# Altium project YC0098_JPXP H93 EOL BASE Tester wiring drawing.PrjPcb
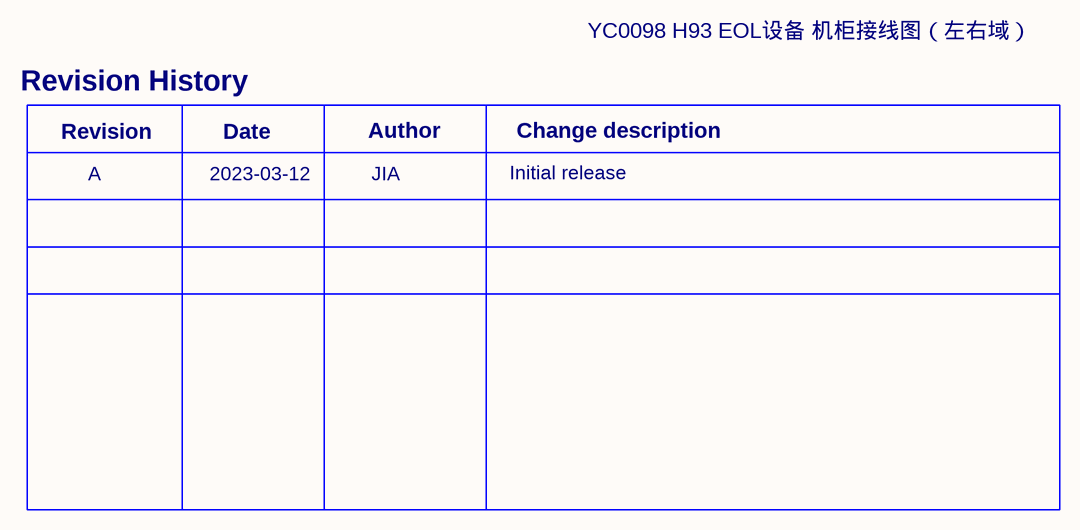
[diagram p0: 0_wiring drawing.SchDoc]
5 sheets, 4 parts. Net scope: flat (ports and power ports of the same name join across sheets).
Sheets:
  0_wiring drawing.SchDoc
  1_wiring drawing.SchDoc
  2_wiring drawing.SchDoc
  3_wiring drawing.SchDoc
  4_wiring drawing.SchDoc

## Sheet 0_wiring drawing.SchDoc: History
size A4; CheckedBy: Among; DrawnBy: Jack; Address1: 1; Address2: 2; Address3: 3; Address4: 4; DocumentNumber: 04-TE-42-4015-0PA-A; Revision: B; SheetNumber: 1; SheetTotal: 5; SheetSize: A4; CheckedByDate: 2022-01-11; DrawByDate: 2022-01-11; SiteName: Huangpu Test Development; ProjectName: 19205_BMW CCU DDR PCBA FT fixture wiring

### Notes on the sheet
- YC0098 H93 EOL设备 机柜接线图（左右域）
- Revision History
- Revision
- Date
- Author
- Initial release
- Change description
- A
- 2023-03-12
- JIA
- Document Number:
- Project Name:
- Rev:
- Drawn By:
- Date:
- Titile:
- Checked By:
- Sheet:
- Of

## Sheet 1_wiring drawing.SchDoc: CAN HUB
size A2; ApprovedBy: Approved By; CheckedBy: Sky; DrawnBy: Jack; Address1: 1; Address2: 2; Address3: 3; Address4: 4; DocumentNumber: 04-TE-42-4015-0PA-A; Revision: B; SheetNumber: 2; SheetTotal: 6; SheetSize: A2; CheckedByDate: 2022-11-19; DrawByDate: 2022-11-17; SiteName: EMS TD Huangpu; PageSetup: Record=PageOptions|CenterHorizontal=True|CenterVertical=True|PrintScale=0.73|XCorrection=1.00|YCorrection=1.00|PrintKind=0|BorderSize=5000000|LeftOffset=0|BottomOffset=0|Orientation=2|PaperLength=1000|PaperWidth=1000|Scale=100|PaperSource=15|PrintQuality=1200|MediaType=1|DitherType=10|PaperKind=A3|PrintScaleMode=1; ProjectName: 19205_BMW CCU DDR PCBA FT fixture wiring
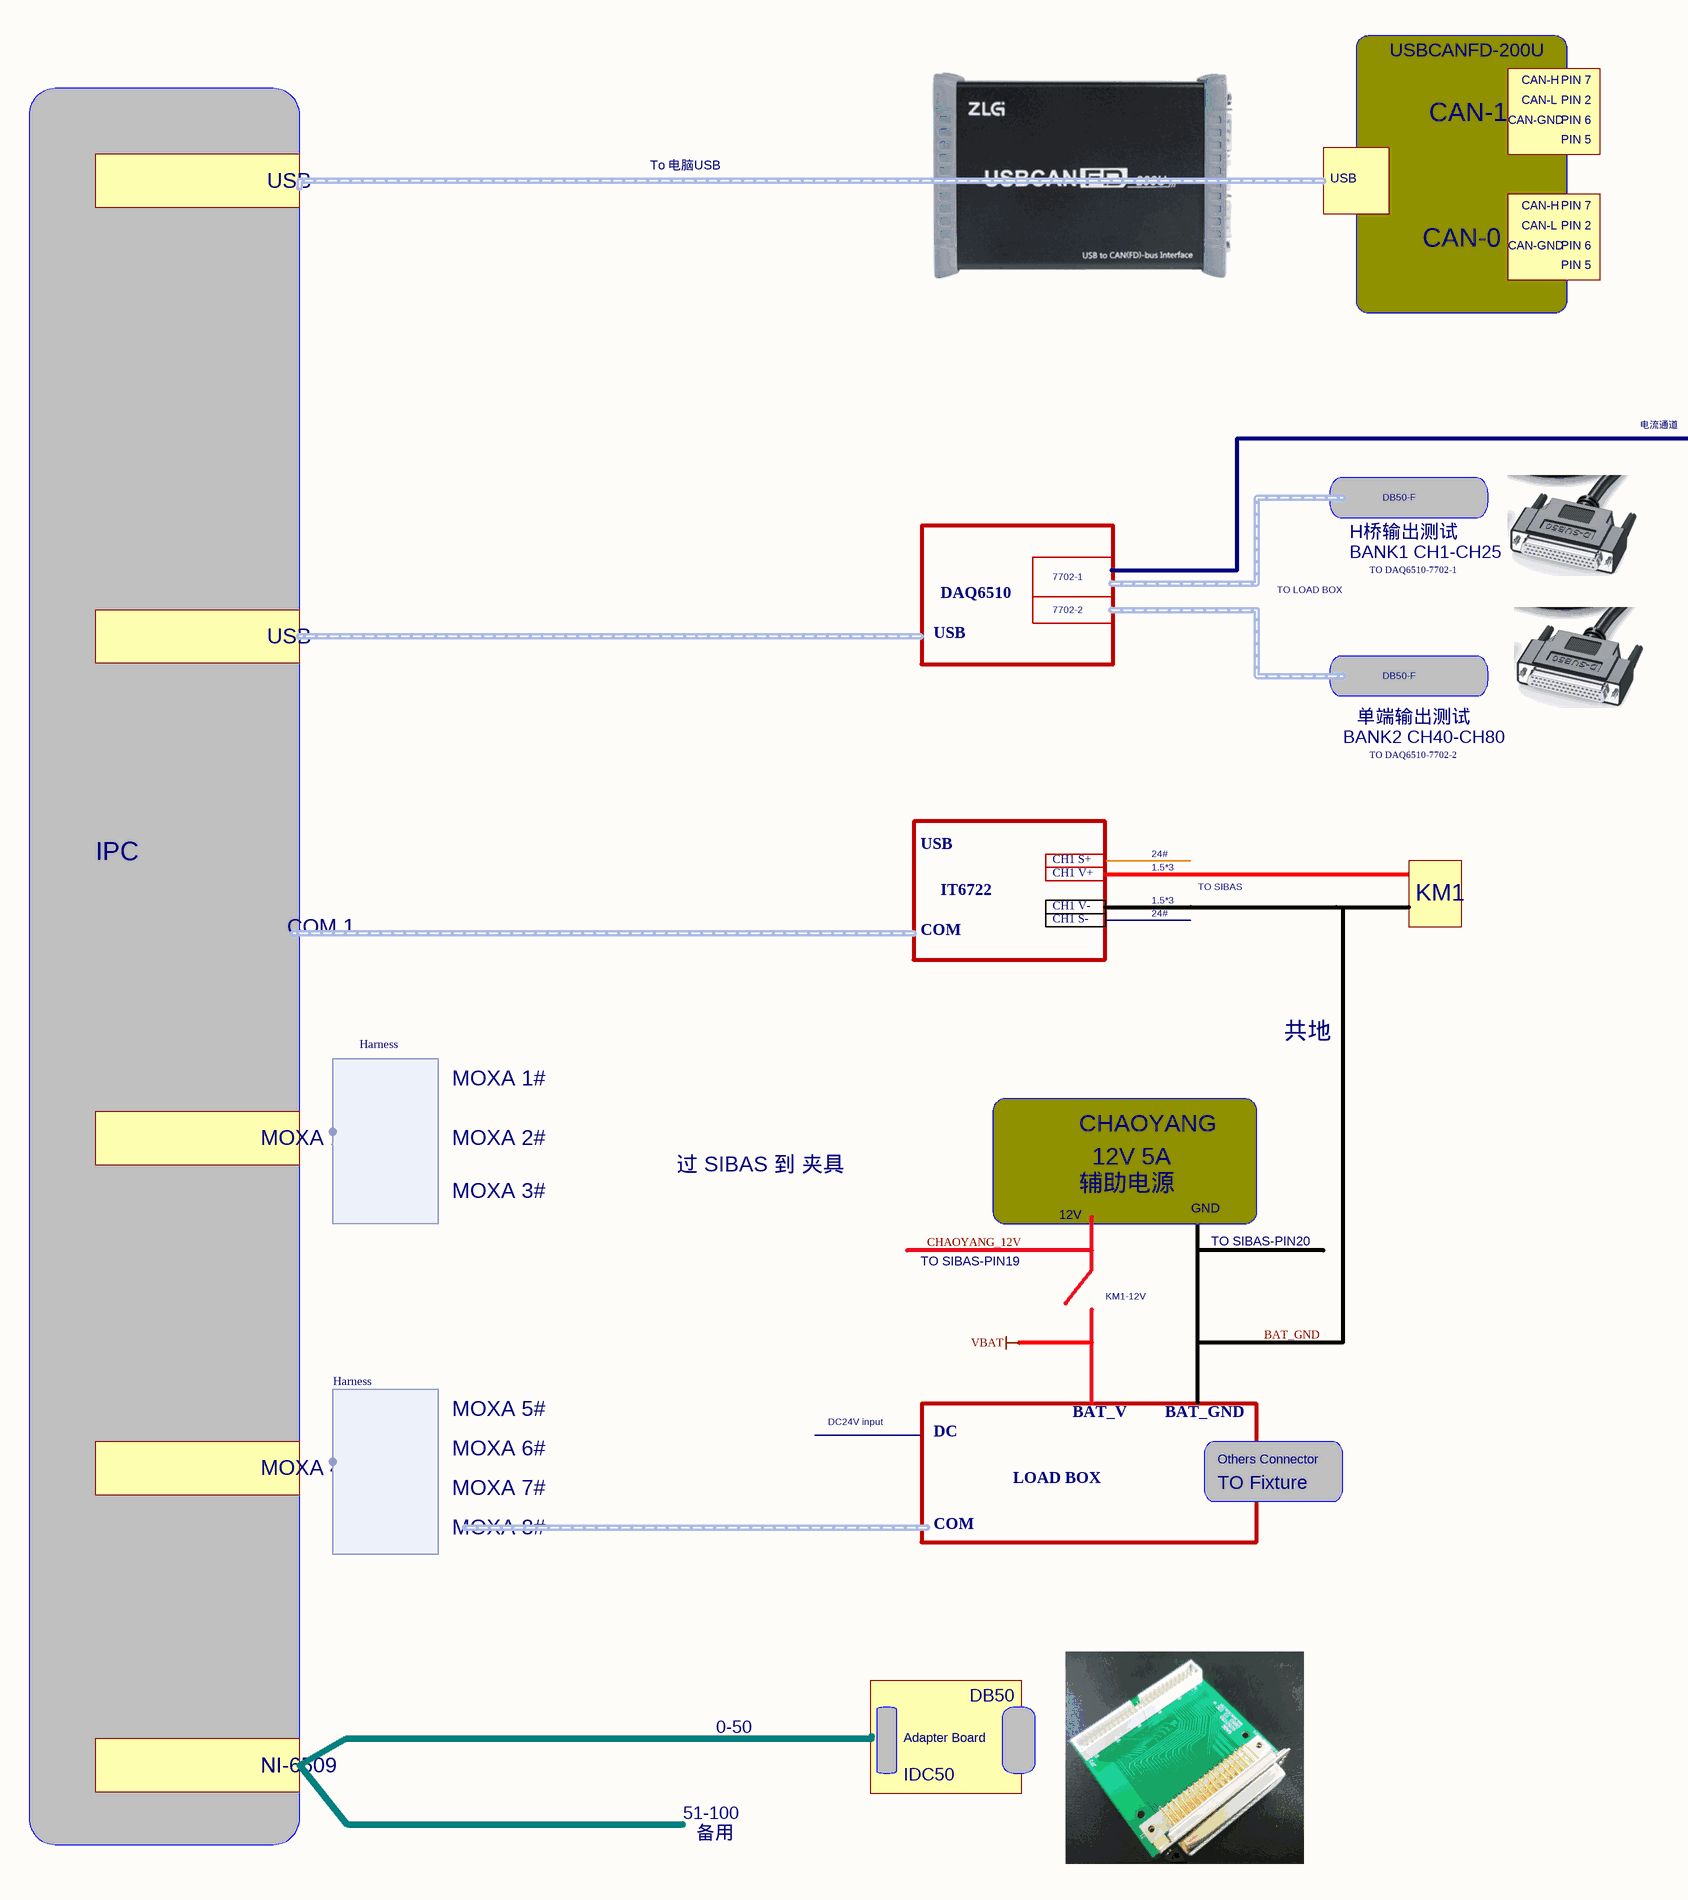
[diagram p1: 1_wiring drawing.SchDoc, left]
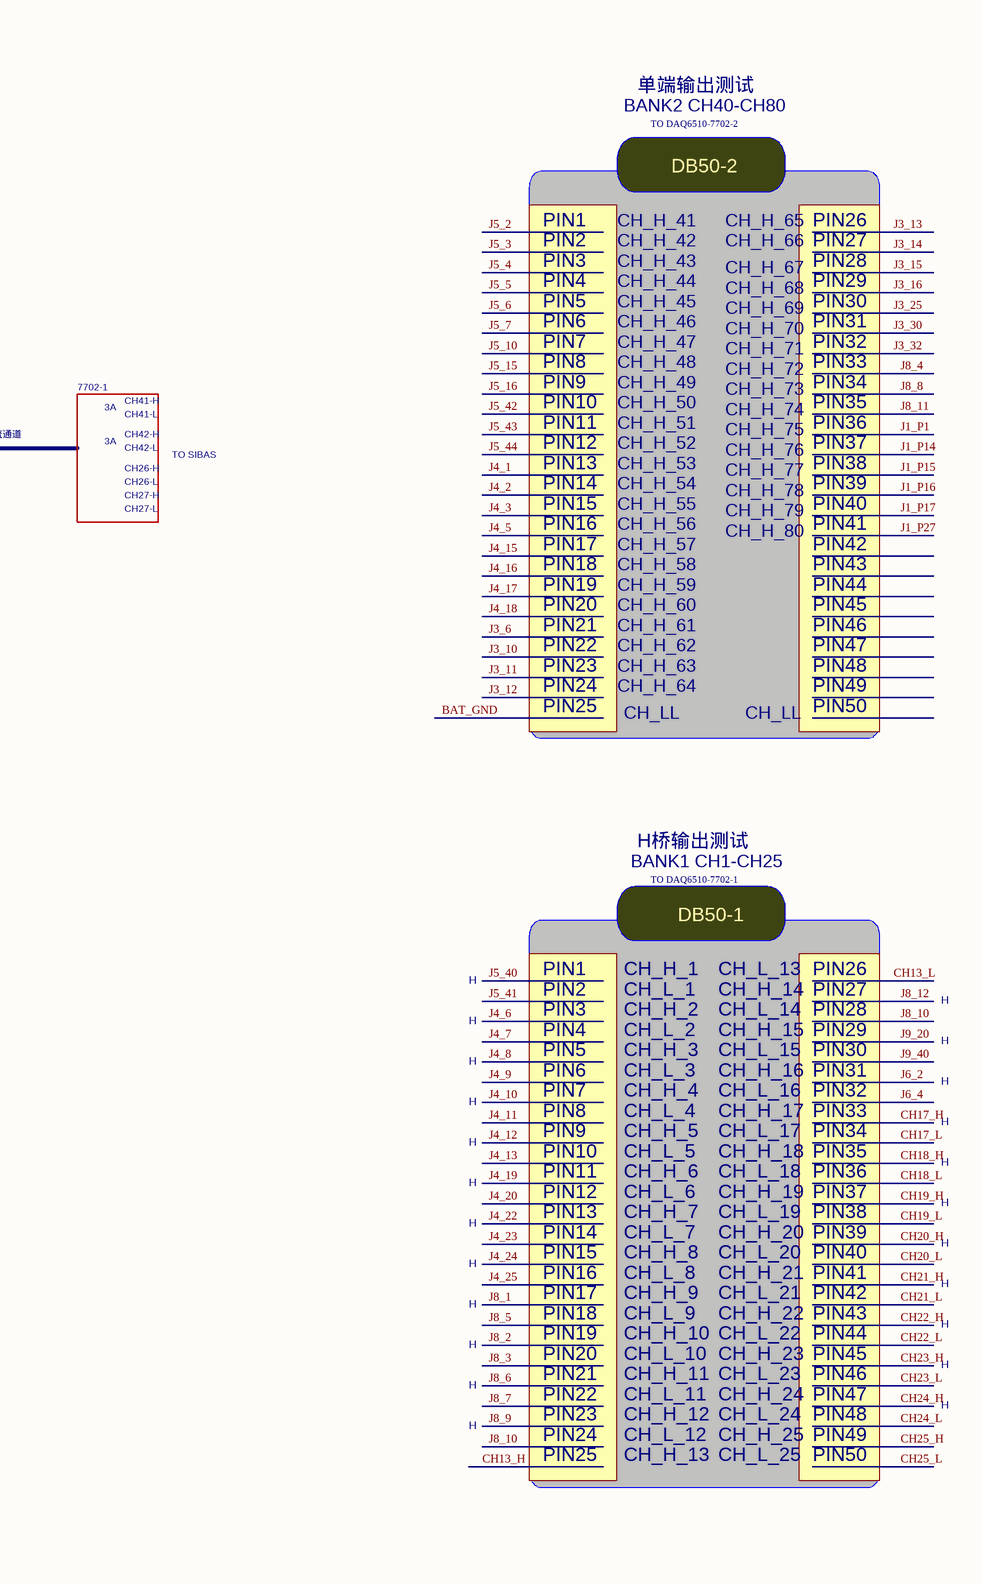
[diagram p2: 1_wiring drawing.SchDoc, right]

### Harnesses
Harness: 

### Notes on the sheet
- USBCANFD-200U
- CAN-H
- CAN-L
- PIN 2
- PIN 7
- BANK2 CH40-CH80
- 单端输出测试
- To 电脑USB
- USB
- CAN-1
- CAN-GND
- PIN 6
- PIN 5
- TO DAQ6510-7702-2
- DB50-2
- PIN1
- PIN2
- CH_H_41
- CH_H_42
- CH_H_65
- CH_H_66
- PIN26
- PIN27
- CAN-0
- PIN3
- PIN4
- PIN5
- CH_H_43
- CH_H_44
- CH_H_45
- CH_H_67
- CH_H_68
- CH_H_69
- PIN28
- PIN29
- PIN30
- PIN6
- PIN7
- PIN8
- CH_H_46
- CH_H_47
- CH_H_48
- CH_H_70
- CH_H_71
- CH_H_72
- PIN31
- PIN32
- PIN33
- 电流通道
- 7702-1
- 3A
- CH41-H
- CH41-L
- CH42-L
- CH42-H
- TO SIBAS
- PIN9
- PIN10
- PIN11
- PIN12
- CH_H_49
- CH_H_50
- CH_H_51
- CH_H_52
- CH_H_73
- CH_H_74
- CH_H_75
- CH_H_76
- PIN34
- PIN35
- PIN36
- PIN37
- DB50-F
- CH26-H
- CH26-L
- CH27-H
- CH27-L
- PIN13
- PIN14
- PIN15
- CH_H_53
- CH_H_54
- CH_H_55
- CH_H_77
- CH_H_78
- CH_H_79
- PIN38
- PIN39
- PIN40
- H桥输出测试
- BANK1 CH1-CH25
- TO DAQ6510-7702-1
- PIN16
- PIN17
- PIN18
- PIN19
- CH_H_56
- CH_H_57
- CH_H_58
- CH_H_59
- CH_H_80
- PIN41
- PIN42
- PIN43
- PIN44
- DAQ6510
- 7702-2
- TO LOAD BOX
- PIN20
- PIN21
- PIN22
- CH_H_60
- CH_H_61
- CH_H_62
- PIN45
- PIN46
- PIN47
- PIN23
- PIN24
- PIN25
- CH_H_63
- CH_H_64
- CH_LL
- PIN48
- PIN49
- PIN50
- IPC
- IT6722
- 1.5*3
- 24#
- KM1
- DB50-1
- COM 1
- COM
- H
- CH_H_1
- CH_L_1
- CH_H_14
- CH_L_13
- CH_H_2
- CH_H_3
- CH_L_2
- CH_H_15
- CH_L_14
- CH_L_15
- MOXA 1#
- 共地
- CH_H_4
- CH_L_3
- CH_L_4
- CH_H_16
- CH_H_17
- CH_L_16
- MOXA 1-3
- MOXA 2#
- CHAOYANG
- 12V 5A
- CH_H_5
- CH_H_6
- CH_L_5
- CH_H_18
- CH_L_18
- CH_L_17
- MOXA 3#
- 过 SIBAS 到 夹具
- 12V
- 辅助电源
- GND
- CH_H_7
- CH_H_8
- CH_L_6
- CH_L_7
- CH_H_19
- CH_H_20
- CH_L_19
- CH_L_20
- TO SIBAS-PIN19
- KM1-12V
- TO SIBAS-PIN20
- CH_H_9
- CH_L_8
- CH_L_9
- CH_H_21
- CH_H_22
- CH_L_21
- CH_H_10
- CH_H_11
- CH_L_10
- CH_L_11
- CH_H_23
- CH_H_24
- CH_L_22
- CH_L_23
- MOXA 5#
- DC24V input
- BAT_V
- BAT_GND
- CH_H_12
- CH_H_13
- CH_L_12
- CH_H_25
- CH_L_24
- CH_L_25
- MOXA 4-8
- MOXA 6#
- MOXA 7#
- DC
- LOAD BOX
- TO Fixture
- Others Connector
- MOXA 8#
- 0-50
- Adapter Board
- DB50
- NI-6509
- 51-100
- IDC50
- 备用
- Labels drawn without touching a wire or pin: BAT_GND, CH1 S+, CH1 S-, CH1 V+, CH1 V-, CHAOYANG_12V
- Document Number:
- Rev:
- Project Name:
- Drawn By:
- Date:
- Titile:
- Checked By:
- Sheet:
- Of

## Sheet 2_wiring drawing.SchDoc: POWER & IGON
size A2; ApprovedBy: Approved By; CheckedBy: Sky Ma; DrawnBy: Jack; Address1: 1; Address2: 2; Address3: 3; Address4: 4; DocumentNumber: 04-TE-42-4015-0PA-A; Revision: B; SheetNumber: 3; SheetTotal: 6; SheetSize: A2; CheckedByDate: 2022-11-19; DrawByDate: 2022-11-19; SiteName: EMS TD Huangpu; : Record=PageOptions|CenterHorizontal=True|CenterVertical=True|PrintScale=0.73|XCorrection=1.00|YCorrection=1.00|PrintKind=0|BorderSize=5000000|LeftOffset=0|BottomOffset=0|Orientation=2|PaperLength=1000|PaperWidth=1000|Scale=100|PaperSource=15|PrintQuality=1200|MediaType=1|DitherType=10|PaperKind=A3|Pr; PageSetup: Record=PageOptions|CenterHorizontal=True|CenterVertical=True|PrintScale=0.52|XCorrection=1.00|YCorrection=1.00|PrintKind=0|BorderSize=5000000|LeftOffset=0|BottomOffset=0|Orientation=2|PaperLength=1000|PaperWidth=1000|Scale=100|PaperSource=15|PrintQuality=1200|MediaType=1|DitherType=10|PaperKind=A4|PrintScaleMode=1; ProjectName: 19205_BMW CCU DDR PCBA FT fixture wiring
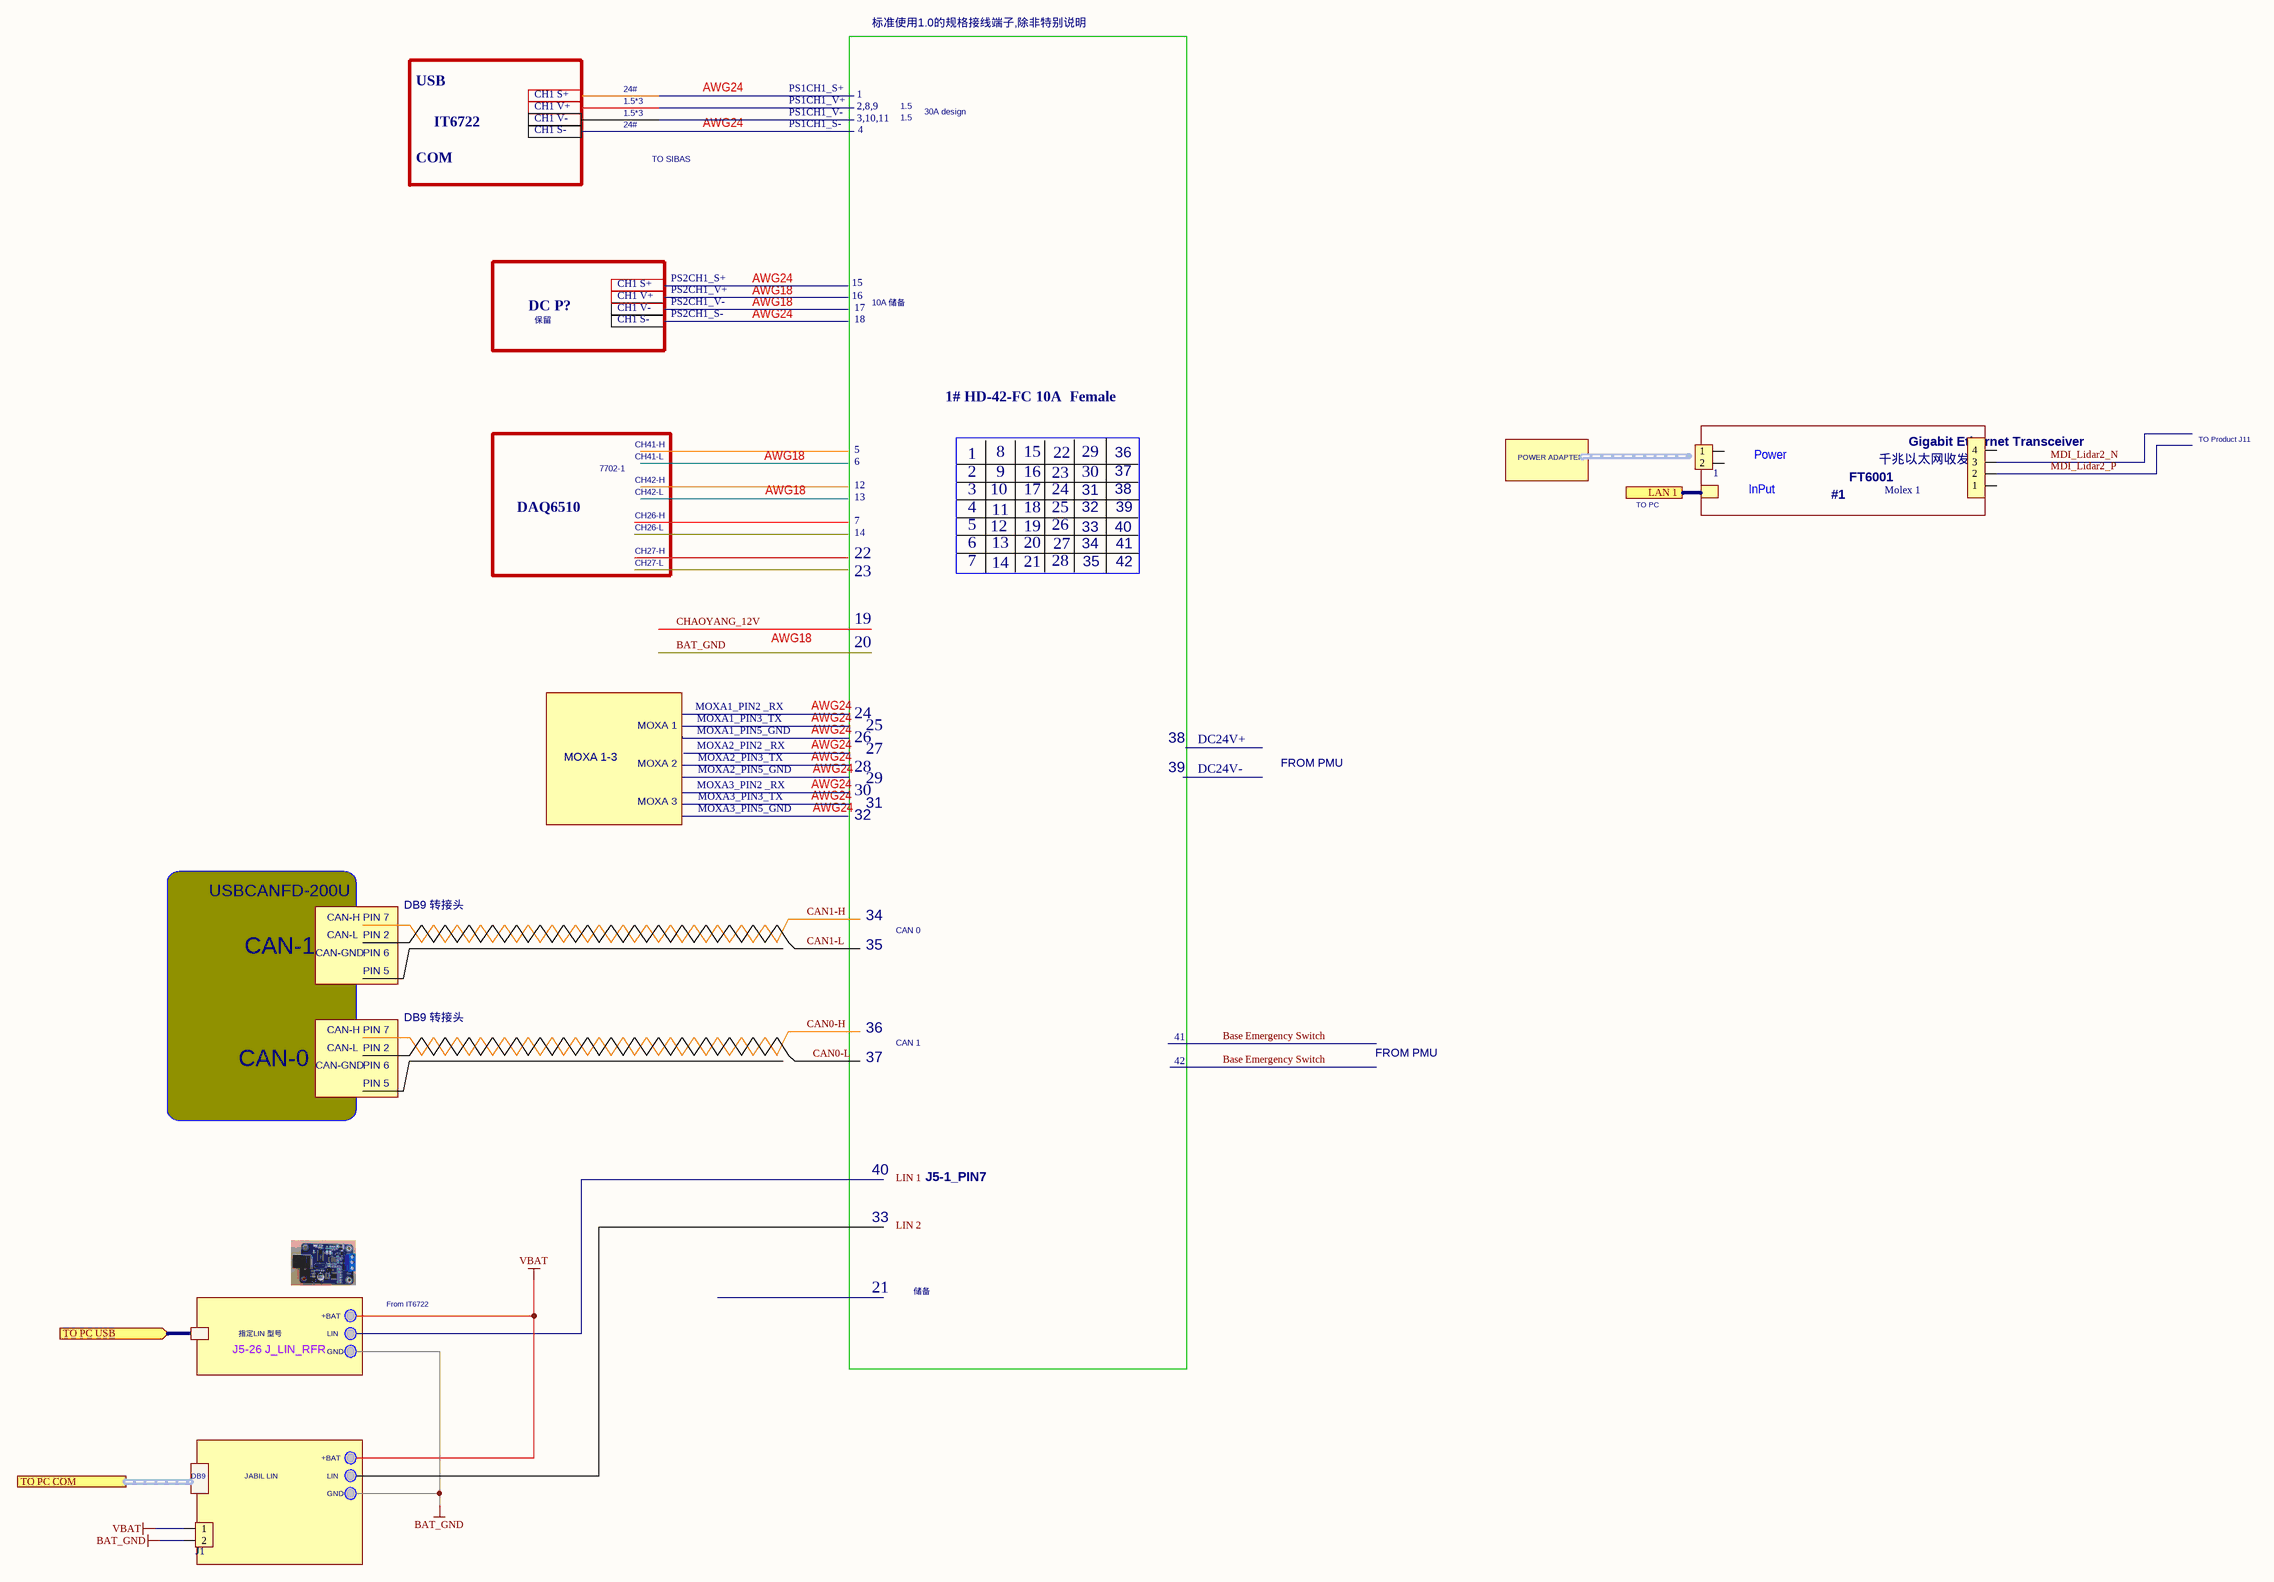
[diagram p3: 2_wiring drawing.SchDoc]

### Parts
1  2.54 connector  [2.54mm-2]  (value not drawn)
J1  5.08mm conncetor  [5.08mm-2-Bend]  (value not drawn)
Molex_1  2.54 connector  [2.54mm-4]  (value not drawn)

### Ports
LAN 1 (in), TO PC COM, TO PC USB (in)

### Nets
BAT_GND: J1.2
VBAT: J1.1
MDI_Lidar2_N: Molex_1.3
MDI_Lidar2_P: Molex_1.2

Not connected (* = marked no-connect by the designer): 1 1 2; Molex_1 1 4

### Notes on the sheet
- 标准使用1.0的规格接线端子,除非特别说明
- USB
- 1.5*3
- 24#
- AWG24
- 1
- 2,8,9
- 3,10,11
- 1.5
- 30A design
- COM
- IT6722
- TO SIBAS
- 4
- AWG18
- 15
- DC P?
- 保留
- 16
- 17
- 18
- 10A 储备
- 1# HD-42-FC 10A  Female
- 7702-1
- CH41-H
- CH41-L
- 6
- 5
- 8
- 22
- 29
- 36
- 37
- POWER ADAPTER
- (near 1) Power
- 千兆以太网收发器
- (near 1) Gigabit Ethernet Transceiver
- TO Product J11
- DAQ6510
- CH42-L
- CH42-H
- CH26-H
- CH26-L
- 12
- 13
- 7
- 2
- 3
- 10
- 11
- 9
- 19
- 23
- 24
- 25
- 26
- 30
- 31
- 32
- 33
- 38
- 40
- 39
- TO PC
- (near 1) InPut
- #1
- FT6001
- CH27-H
- CH27-L
- 14
- 20
- 21
- 28
- 27
- 34
- 35
- 42
- 41
- MOXA 1-3
- MOXA 1
- MOXA 2
- DC24V+
- FROM PMU
- MOXA 3
- DC24V-
- USBCANFD-200U
- CAN-H
- CAN-L
- PIN 2
- PIN 7
- DB9 转接头
- CAN 0
- CAN-1
- CAN-GND
- PIN 6
- PIN 5
- CAN-0
- CAN 1
- J5-1_PIN7
- From IT6722
- 储备
- 指定LIN 型号
- +BAT
- LIN
- GND
- DB9
- JABIL LIN
- Labels drawn without touching a wire or pin: CAN0-H, CAN0-L, CAN1-H, CAN1-L, CH1 S+, CH1 S-, CH1 V+, CH1 V-, J5-26 J_LIN_RFR, LIN 1, LIN 2
- Document Number:
- Rev:
- Project Name:
- Drawn By:
- Date:
- Titile:
- Checked By:
- Sheet:
- Of

### Library data of the parts
1 = CON2-2.54
J1 = CON2-5.08
Molex_1 = CON4-2.54

## Sheet 3_wiring drawing.SchDoc: Current sensors and IFB
size A2; ApprovedBy: Approved By; CheckedBy: Among; DrawnBy: Sky Ma; Address1: 1; Address2: 2; Address3: 3; Address4: 4; DocumentNumber: 04-TE-42-4015-0PA-A; Revision: B; SheetNumber: 4; SheetTotal: 6; SheetSize: A2; CheckedByDate: 2022-01-11; DrawByDate: 2022-11-19; SiteName: EMS TD Huangpu; ProjectName: 19205_BMW CCU DDR PCBA FT fixture wiring
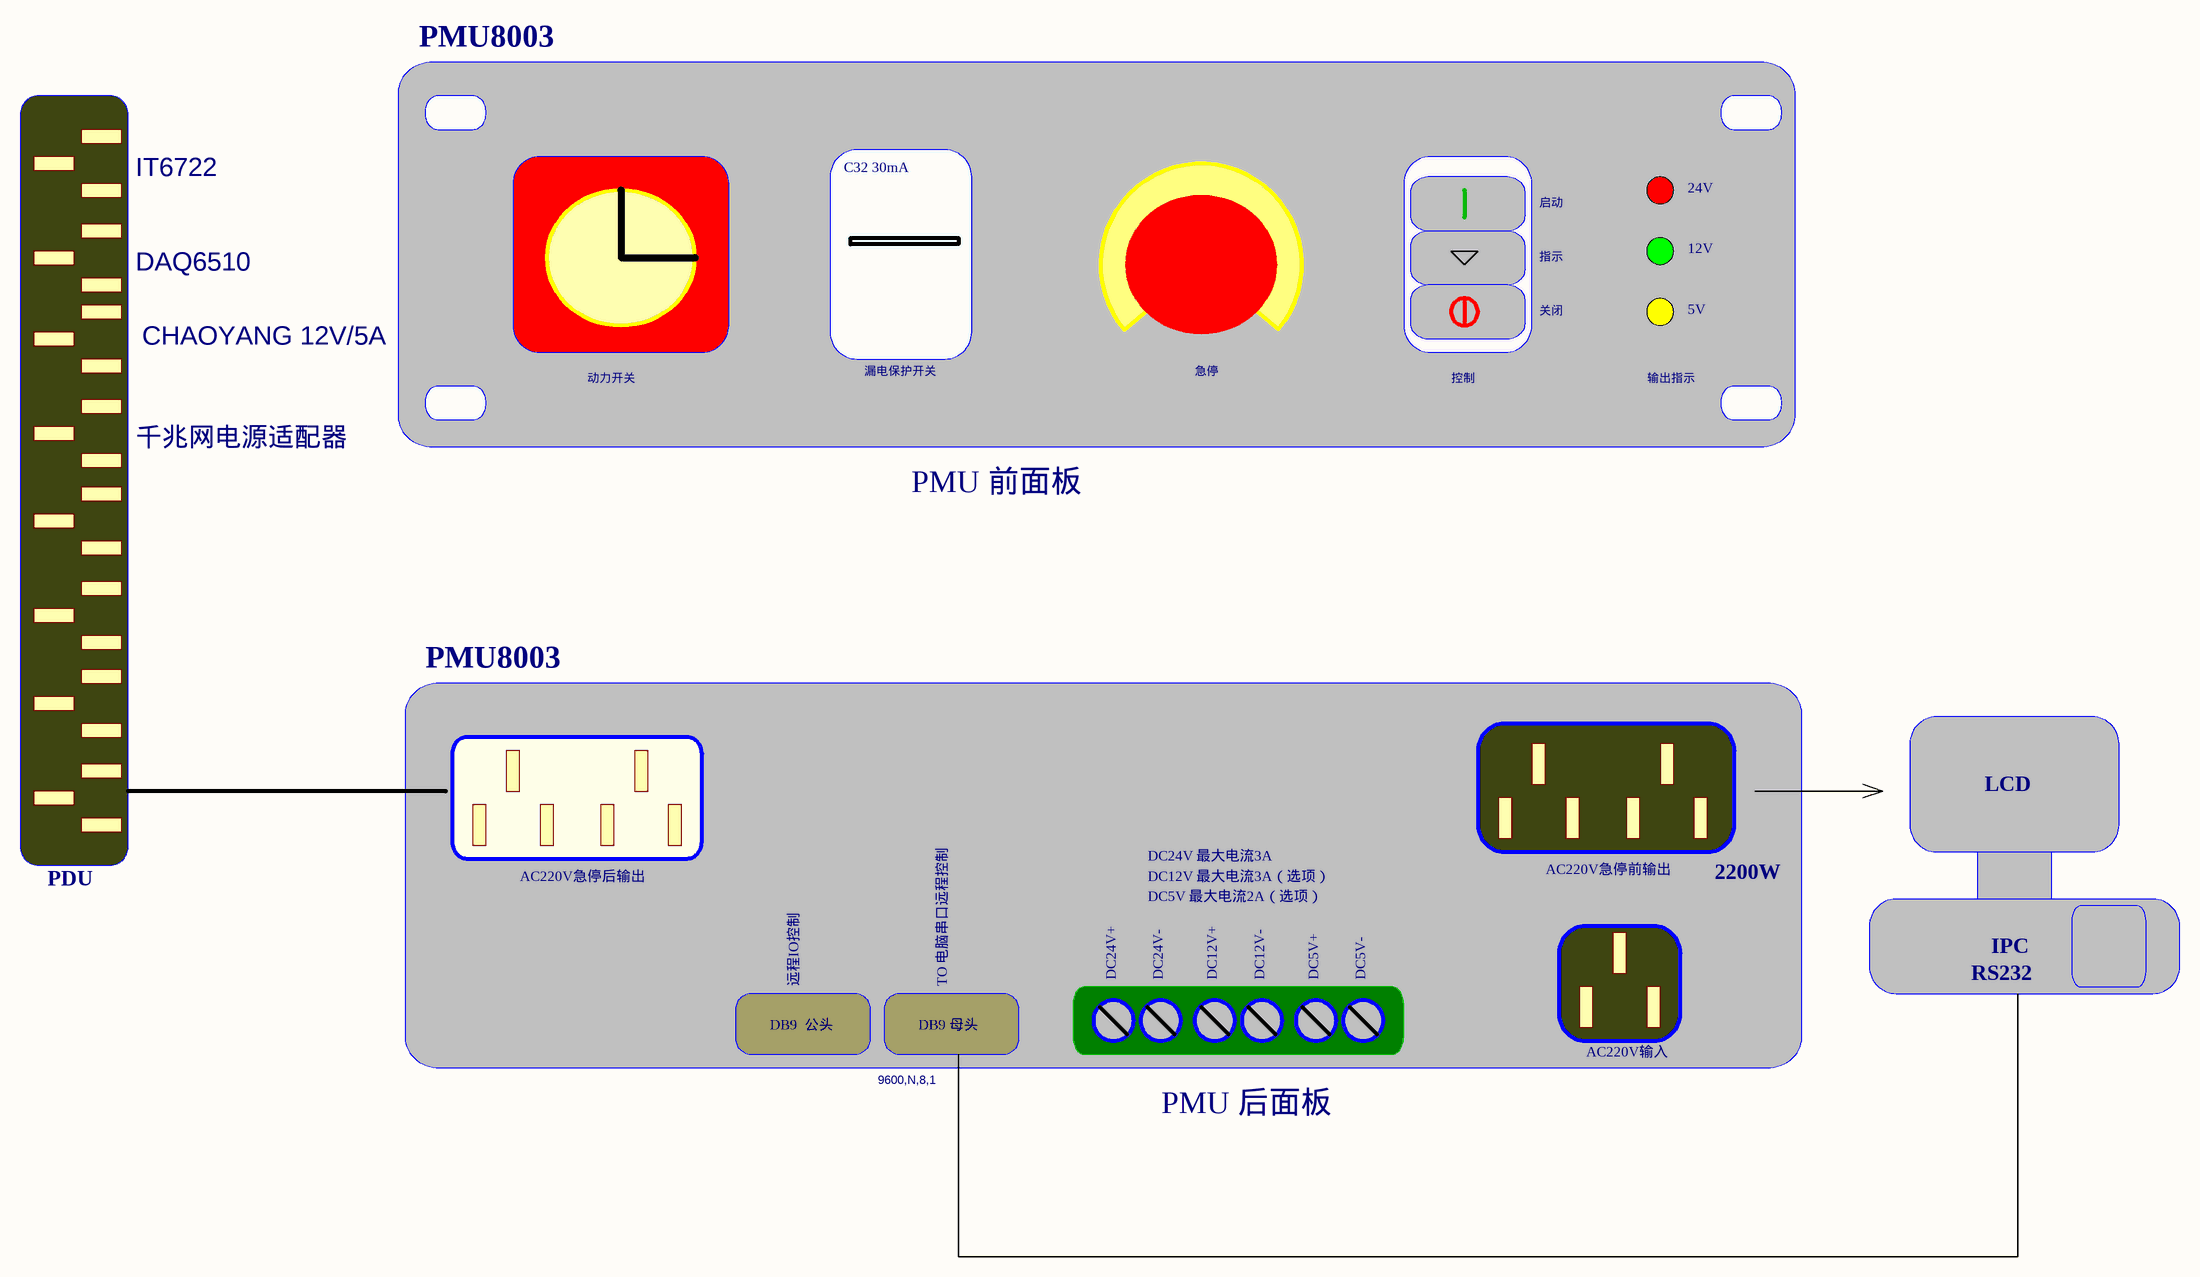
[diagram p4: 3_wiring drawing.SchDoc]

### Notes on the sheet
- PMU8003
- IT6722
- C32 30mA
- 启动
- 24V
- DAQ6510
- 指示
- 12V
- CHAOYANG 12V/5A
- 关闭
- 5V
- 动力开关
- 漏电保护开关
- 急停
- 控制
- 输出指示
- 千兆网电源适配器
- PMU 前面板
- LCD
- PDU
- AC220V急停后输出
- DC24V 最大电流3A
- DC12V 最大电流3A（选项）
- AC220V急停前输出
- 2200W
- DC5V 最大电流2A（选项）
- IPC
- DB9  公头
- 远程IO控制
- DB9 母头
- TO 电脑串口远程控制
- DC24V+
- DC24V-
- DC12V+
- DC12V-
- DC5V+
- DC5V-
- RS232
- 9600,N,8,1
- AC220V输入
- PMU 后面板
- Document Number:
- Rev:
- Project Name:
- Drawn By:
- Date:
- Titile:
- Checked By:
- Sheet:
- Of

## Sheet 4_wiring drawing.SchDoc: DUT POWER ON/OFF CONTROL
size A2; ApprovedBy: Approved By; CheckedBy: Sky Ma; DrawnBy: Jack; Address1: 1; Address2: 2; Address3: 3; Address4: 4; DocumentNumber: 04-TE-42-4015-0PA-A; Revision: A; SheetNumber: 5; SheetTotal: 6; SheetSize: A2; CheckedByDate: 2022-11-19; DrawByDate: 2022-11-19; SiteName: EMS TD Huangpu; ProjectName: 19205_BMW CCU DDR PCBA FT fixture wiring
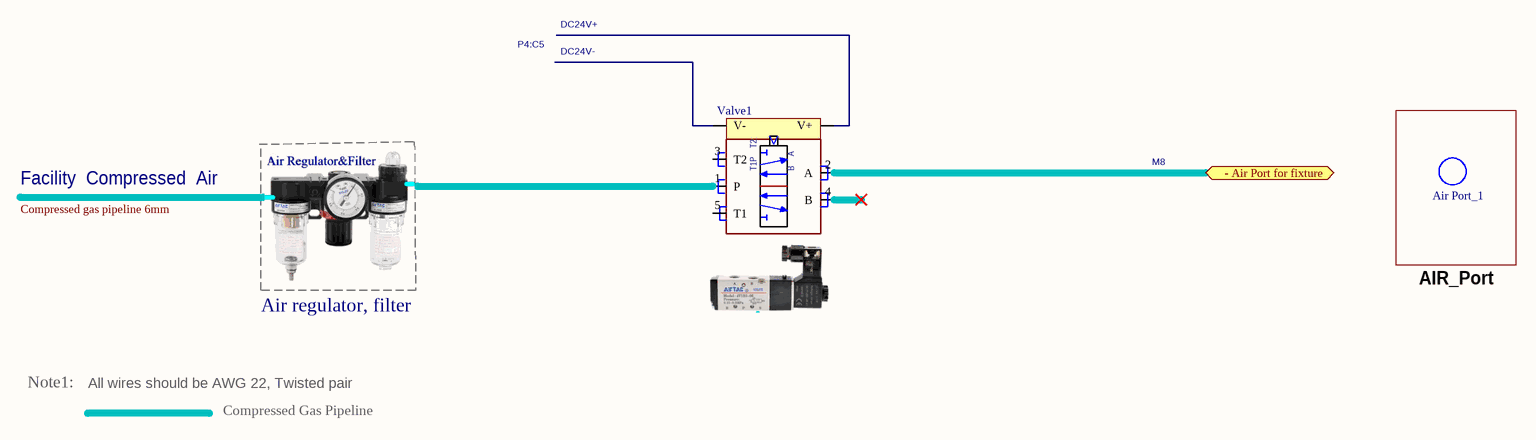
[diagram p5: 4_wiring drawing.SchDoc]

### Parts
Valve1  SMC SY5120-5LZD-01  (value not drawn)

### Ports
- Air Port for fixture

### Nets

Not connected (* = marked no-connect by the designer): Valve1 0(V+) 1(V-) 2(A) 3(T2) 4(B) 5(T1)

### Notes on the sheet
- P4:C5
- DC24V-
- DC24V+
- Facility  Compressed  Air
- M8
- Air Port_1
- AIR_Port
- Air regulator, filter
- Note1:
- All wires should be AWG 22, Twisted pair
- Compressed Gas Pipeline
- Labels drawn without touching a wire or pin: Compressed gas pipeline 6mm
- Document Number:
- Rev:
- Project Name:
- Drawn By:
- Date:
- Titile:
- Checked By:
- Sheet:
- Of

### Library data of the parts
Valve1 = Valve1